# Altium schematic sheet Control.SchDoc
size 431 x 279 mm; Organization: ORGANIZATION; Address1: ADDRESS 1; Address2: ADDRESS 2; Address3: ADDRESS 3; Address4: ADDRESS 4; Revision: -; SheetNumber: 5; SheetTotal: 8; ENG_APP_DATE: --/--/--; DSN_APP_DATE: --/--/--; CHK_APP_DATE: --/--/--; SPICEModelCacheDZCMNMWT: <root> / <DocumentId>DZCMNMWT</DocumentId> / </root>
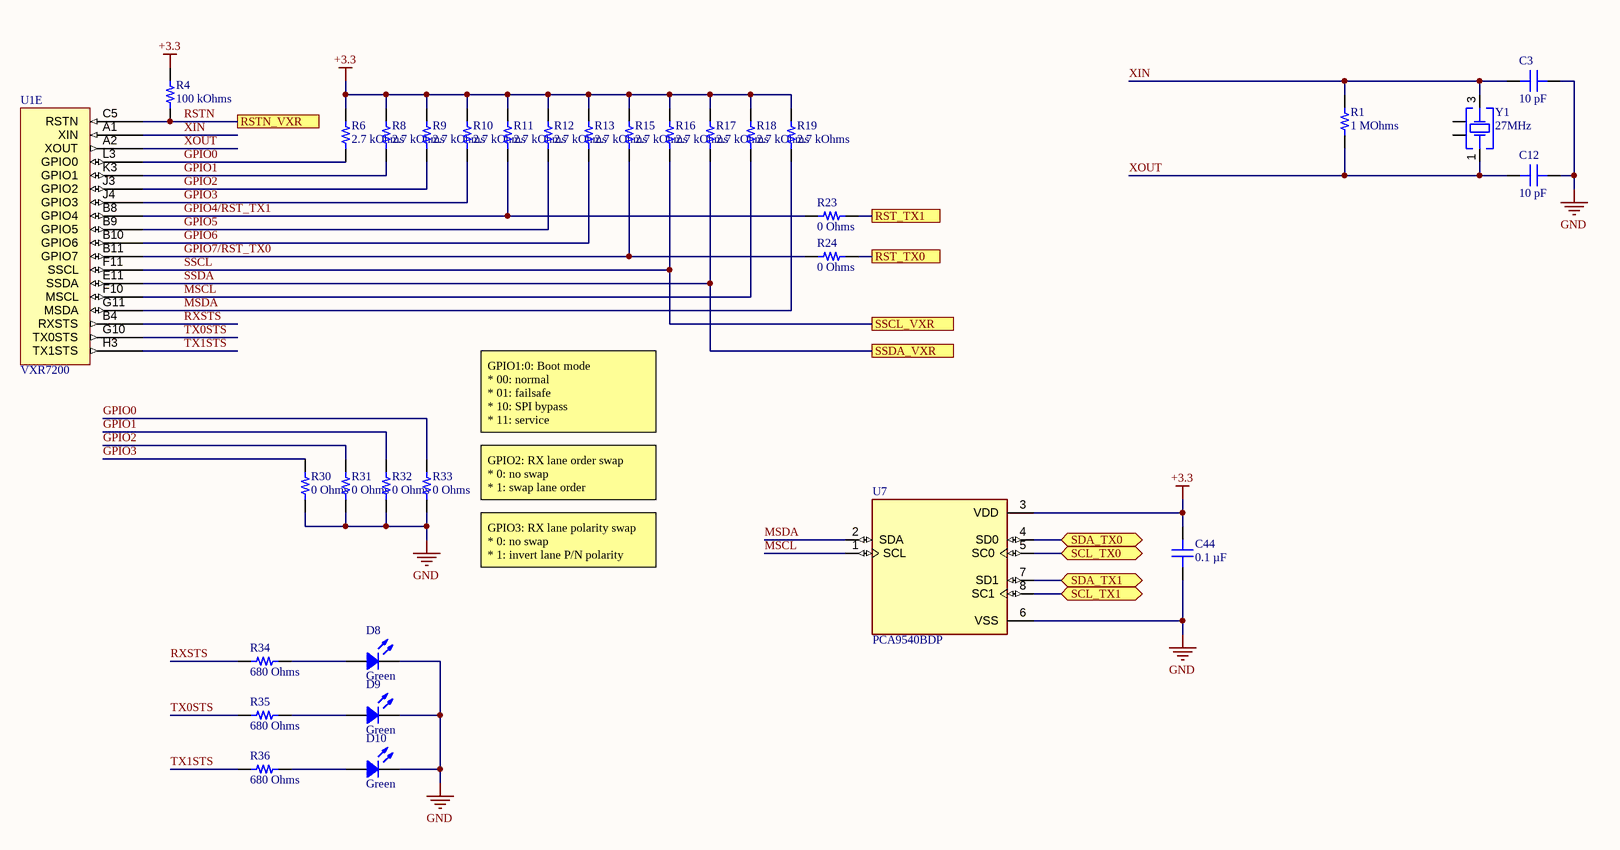
[diagram p0: Control.SchDoc]

## Parts
C3  10 pF  [CAP 0201_0603]
C12  10 pF  [CAP 0201_0603]
C44  0.1 µF  [CAP 0201_0603]
D8  Green  [LED 0603_1608 GREEN]
D9  Green  [LED 0603_1608 GREEN]
D10  Green  [LED 0603_1608 GREEN]
R1  1 MOhms  [RES 0201_0603]
R4  100 kOhms  [RES 0201_0603]
R6  2.7 kOhms  [RES 0201_0603]
R8  2.7 kOhms  [RES 0201_0603]
R9  2.7 kOhms  [RES 0201_0603]
R10  2.7 kOhms  [RES 0201_0603]
R11  2.7 kOhms  [RES 0201_0603]
R12  2.7 kOhms  [RES 0201_0603]
R13  2.7 kOhms  [RES 0201_0603]
R15  2.7 kOhms  [RES 0201_0603]
R16  2.7 kOhms  [RES 0201_0603]
R17  2.7 kOhms  [RES 0201_0603]
R18  2.7 kOhms  [RES 0201_0603]
R19  2.7 kOhms  [RES 0201_0603]
R23  0 Ohms  [RES 0402_1005]
R24  0 Ohms  [RES 0402_1005]
R30  0 Ohms  [RES 0402_1005]
R31  0 Ohms  [RES 0402_1005]
R32  0 Ohms  [RES 0402_1005]
R33  0 Ohms  [RES 0402_1005]
R34  680 Ohms  [RES 0402_1005]
R35  680 Ohms  [RES 0402_1005]
R36  680 Ohms  [RES 0402_1005]
U1  VXR7200  [BGA100P9X9-81A]  (part E of 9)
U7  PCA9540BDP  [SOP65P490X110-8N]
Y1  27MHz  [WE-XTAL_CFPX-218]

## Ports
RST_TX0, RST_TX1, RSTN_VXR, SCL_TX0 (bidir), SCL_TX1 (bidir), SDA_TX0 (bidir), SDA_TX1 (bidir), SSCL_VXR, SSDA_VXR

## Nets
+3.3: C44.2 R4.2 R6.2 R8.2 R9.2 R10.2 R11.2 R12.2 R13.2 R15.2 R16.2 R17.2 R18.2 R19.2 U7.3(VDD)
GND: C3.2 C12.2 C44.1 D8.2 D9.2 D10.2 R30.1 R31.1 R32.1 R33.1 U7.6(VSS)
GPIO0: R6.1 R33.2 U1.L3(GPIO0)
GPIO1: R8.1 R32.2 U1.K3(GPIO1)
GPIO2: R9.1 R31.2 U1.J3(GPIO2)
GPIO3: R10.1 R30.2 U1.J4(GPIO3)
GPIO4/RST_TX1: R11.1 R23.2 U1.B8(GPIO4)
GPIO5: R12.1 U1.B9(GPIO5)
GPIO6: R13.1 U1.B10(GPIO6)
GPIO7/RST_TX0: R15.1 R24.2 U1.B11(GPIO7)
MSCL: R18.1 U1.F10(MSCL) U7.1(SCL)
MSDA: R19.1 U1.G11(MSDA) U7.2(SDA)
RST_TX0: R24.1 ; port RST_TX0
RST_TX1: R23.1 ; port RST_TX1
RSTN: R4.1 U1.C5(RSTN) ; port RSTN_VXR
RXSTS: R34.1 U1.B4(RXSTS)
SCL_TX0: U7.5(SC0) ; port SCL_TX0
SCL_TX1: U7.8(SC1) ; port SCL_TX1
SDA_TX0: U7.4(SD0) ; port SDA_TX0
SDA_TX1: U7.7(SD1) ; port SDA_TX1
SSCL: R16.1 U1.F11(SSCL) ; port SSCL_VXR
SSDA: R17.1 U1.E11(SSDA) ; port SSDA_VXR
TX0STS: R35.1 U1.G10(TX0STS)
TX1STS: R36.1 U1.H3(TX1STS)
XIN: C3.1 R1.2 U1.A1(XIN) Y1.3(Crystal)
XOUT: C12.1 R1.1 U1.A2(XOUT) Y1.1(Crystal)
NetD8_1: D8.1 R34.2
NetD9_1: D9.1 R35.2
NetD10_1: D10.1 R36.2

Not connected (* = marked no-connect by the designer): Y1 2(GND) 4(GND)

## Notes on the sheet
- GPIO1:0: Boot mode
  * 00: normal
  * 01: failsafe
  * 10: SPI bypass
  * 11: service
- GPIO2: RX lane order swap
  * 0: no swap
  * 1: swap lane order
- GPIO3: RX lane polarity swap
  * 0: no swap
  * 1: invert lane P/N polarity
- DWG. NO.
- REV.
- SHT.
- REVISION
- DESCRIPTION
- DATE
- APPROVED
- ENG:
- APPROVALS
- PROJECT
- DSN:
- CHK:
- REFERENCE DOCUMENTS
- PROJECT REVISION:
- TITLE
- SimulaVR
- DOCUMENT REVISION:
- DESIGN ITEM:
- BOM:
- FAB DWG:
- PCB DWG:
- ASSY DWG:
- SCALE:
- SIZE
- B
- CAGE CODE
- FILE NAME
- DWG NO.
- SHEET
- OF
- REV

## Library data of the parts
C3 C12 = GRM0335C1E100JA01D: CAP CER 10PF 25V C0G/NP0 0201; manufacturer: Murata Electronics; Temperature Coefficient: C0G, NP0; Tolerance: ±5%; Part Number: GRM0335C1E100JA01D; Value: 10 pF; Applications: General Purpose; Capacitance: 10 pF; componentlink1description: Datasheet; componentlink1url: https://search.murata.co.jp/Ceramy/image/img/A01X/G101/ENG/GRM0335C1E100JA01-01.pdf; componentlink2description: DigiKey Link; componentlink2url: https://www.digikey.com/en/products/detail/murata-electronics/GRM0335C1E100JA01D/4358173; Device Package: 0201 (0603 Metric); lastupdated: 2022-04-12 22:02:08; Lifecycle Status: Active; Minimum Order: 1; Mounting Type: Surface Mount, MLCC; Operating Temperature: -55°C ~ 125°C; Package / Case: 0201 (0603 Metric); packaging: CutTape; partid: 180; Part Status: Active; price: 0.01; series: GRM; Size / Dimension: 0.024" L x 0.012" W (0.60mm x 0.30mm); Supplier 1: DigiKey; Supplier Part Number 1: 490-8607-1-ND; Thickness (Max): 0.013" (0.33mm); Voltage - Rated: 25V
C44 = GRM033R61E104KE14D: CAP CER 0.1UF 25V X5R 0201; manufacturer: Murata Electronics; Tolerance: ±10%; Part Number: GRM033R61E104KE14D; Value: 0.1 µF; Applications: General Purpose; Capacitance: 0.1 µF; componentlink1description: Datasheet; componentlink1url: https://search.murata.co.jp/Ceramy/image/img/A01X/G101/ENG/GRM033R61E104KE14-01.pdf; componentlink2description: DigiKey Link; componentlink2url: https://www.digikey.com/en/products/detail/murata-electronics/GRM033R61E104KE14D/4904731; Device Package: 0201 (0603 Metric); lastupdated: 5/20/2022 2:33:00 PM; Lifecycle Status: Active; Minimum Order: 1; Mounting Type: Surface Mount; Operating Temperature: -55°C ~ 85°C; Package / Case: 0201 (0603 Metric); packaging: TapeAndReel; partid: 39731; Part Status: Active; price: 0.01; series: GRM; Size / Dimension: 0.024" L x 0.012" W (0.60mm x 0.30mm); Supplier 1: DigiKey; Supplier Part Number 1: 490-12686-1-ND; Temperature Coefficient: X5R; Thickness (Max): 0.013" (0.33mm); Voltage - Rated: 25V
D8-D10 = 150060GS55040: LED GREEN DIFFUSED 0603 SMD; Manufacturer: Würth Elektronik; Configuration: Standard; Current - Test: 20mA; Lens Color: 0.50mm; Lens Size: 1.00mm x 0.80mm; Lens Style: Rectangle with Flat Top; Millicandela Rating: 430mcd; Viewing Angle: 140°; Voltage - Forward (Vf) (Typ): 3.2V; Wavelength - Dominant: 525nm; Wavelength - Peak: 520nm; Part Number: 150060GS55040; Color: Green; ComponentLink1Description: Datasheet; ComponentLink1URL: https://www.we-online.de/web/en/index.php/download/media/07_electronic_components/download_center_1/application_notes_berichte/ano002_leds___the_future_of_horticultural_lighting/ANO002b_EN_LEDs_The_Future_of_Horticultural_Lighting.pdf; ComponentLink2Description: DigiKey Link; ComponentLink2URL: https://www.digikey.com/en/products/detail/würth-elektronik/150060GS55040/8557179; Device Package: 0603 (1608 Metric); Height (Max): 0.50mm; LastUpdated: 2022-04-12 22:51:58; Lens Transparency: Diffused; Lifecycle Status: Active; Minimum Order: 1; Mounting Type: Surface Mount; Package / Case: 0603 (1608 Metric); Packaging: TapeAndReel; PartId: 673; Part Status: Active; Price: 0.13; Series: WL-SMDC; Size / Dimension: 1.60mm L x 0.80mm W; Supplier 1: DigiKey; Supplier Part Number 1: 732-12014-1-ND; Supplier Device Package: 0603 (1608 Metric); Value: Green
R1 = CRCW02011M00FKED: RES SMD 1M OHM 1% 1/20W 0201; Manufacturer: Vishay Dale; Power (Watts): 0.05W, 1/20W; Temperature Coefficient: ±100ppm/°C; Part Number: CRCW02011M00FKED; Value: 1 MOhms; ComponentLink1Description: Datasheet; ComponentLink1URL: http://www.vishay.com/docs/20052/crcw0201e3.pdf; ComponentLink2Description: DigiKey Link; ComponentLink2URL: https://www.digikey.com/en/products/detail/vishay-dale/CRCW02011M00FKED/1968003; Composition: Thick Film; Device Package: 0201 (0603 Metric); Height - Seated (Max): 0.010" (0.26mm); LastUpdated: 2022-04-12 22:16:01; Lifecycle Status: Active; Minimum Order: 1; Number of Terminations: 2; Operating Temperature: -55°C ~ 155°C; Package / Case: 0201 (0603 Metric); Packaging: TapeAndReel; PartId: 30; Part Status: Active; Price: 0.03; Resistance: 1 MOhms; Series: CRCW; Size / Dimension: 0.024" L x 0.012" W (0.60mm x 0.30mm); Supplier 1: DigiKey; Supplier Part Number 1: 541-1.00MAABCT-ND; Supplier Device Package: 0201; Tolerance: ±1%
R4 = ERJ-U01F1003C: RES 100K OHM 1% 1/20W 0201 SMD; Manufacturer: Panasonic Electronic Components; Power (Watts): 0.05W, 1/20W; Temperature Coefficient: ±200ppm/°C; Part Number: ERJ-U01F1003C; Value: 100 kOhms; ComponentLink1Description: Datasheet; ComponentLink1URL: https://industrial.panasonic.com/cdbs/www-data/pdf/RDP0000/AOA0000C334.pdf; ComponentLink2Description: DigiKey Link; ComponentLink2URL: https://www.digikey.com/en/products/detail/panasonic-electronic-components/ERJ-U01F1003C/11631500; Composition: Thick Film; Device Package: 0201 (0603 Metric); Features: Anti-Sulfur; Height - Seated (Max): 0.010" (0.26mm); LastUpdated: 2022-04-12 22:15:26; Lifecycle Status: Active; Minimum Order: 1; Number of Terminations: 2; Operating Temperature: -55°C ~ 125°C; Package / Case: 0201 (0603 Metric); Packaging: TapeAndReel; PartId: 64617; Part Status: Active; Price: 0.05; Resistance: 100 kOhms; Series: ERJ-U01; Size / Dimension: 0.024" L x 0.012" W (0.60mm x 0.30mm); Supplier 1: DigiKey; Supplier Part Number 1: 10-ERJ-U01F1003CCT-ND; Supplier Device Package: 0201; Tolerance: ±1%
R6 R8-R13 R15-R19 = ERJ-U01J272C: RES 2.7K OHM 5% 1/20W 0201 SMD; Manufacturer: Panasonic Electronic Components; Power (Watts): 0.05W, 1/20W; Temperature Coefficient: ±200ppm/°C; Part Number: ERJ-U01J272C; Value: 2.7 kOhms; ComponentLink1Description: Datasheet; ComponentLink1URL: https://industrial.panasonic.com/cdbs/www-data/pdf/RDP0000/AOA0000C334.pdf; ComponentLink2Description: DigiKey Link; ComponentLink2URL: https://www.digikey.com/en/products/detail/panasonic-electronic-components/ERJ-U01J272C/11641374; Composition: Thick Film; Device Package: 0201 (0603 Metric); Features: Anti-Sulfur; Height - Seated (Max): 0.010" (0.26mm); LastUpdated: 2022-04-12 22:15:26; Lifecycle Status: Active; Minimum Order: 1; Number of Terminations: 2; Operating Temperature: -55°C ~ 125°C; Package / Case: 0201 (0603 Metric); Packaging: TapeAndReel; PartId: 64645; Part Status: Active; Price: 0.04; Resistance: 2.7 kOhms; Series: ERJ-U01; Size / Dimension: 0.024" L x 0.012" W (0.60mm x 0.30mm); Supplier 1: DigiKey; Supplier Part Number 1: 10-ERJ-U01J272CCT-ND; Supplier Device Package: 0201; Tolerance: ±5%
R23 R24 R30-R33 = AC0402FR-070RL: RESISTOR 0402 JUMPER ZERO OHM; Manufacturer: Yageo; Power (Watts): 0.063W, 1/16W; Part Number: AC0402FR-070RL; Value: 0 Ohms; ComponentLink1Description: Datasheet; ComponentLink1URL: https://www.yageo.com/upload/media/product/productsearch/datasheet/rchip/PYu-AC_51_RoHS_L_8.pdf; ComponentLink2Description: DigiKey Link; ComponentLink2URL: https://www.digikey.com/en/products/detail/yageo/AC0402FR-070RL/12082398; Composition: Thick Film; Device Package: 0402 (1005 Metric); Features: Automotive AEC-Q200, Moisture Resistant; Height - Seated (Max): 0.015" (0.37mm); LastUpdated: 2022-04-12 22:19:37; Lifecycle Status: Active; Minimum Order: 1; Number of Terminations: 2; Operating Temperature: -55°C ~ 155°C; Package / Case: 0402 (1005 Metric); Packaging: CutTape; PartId: 66976; Part Status: Active; Price: 0.01; Ratings: AEC-Q200; Resistance: 0 Ohms; Series: AC; Size / Dimension: 0.039" L x 0.020" W (1.00mm x 0.50mm); Supplier 1: DigiKey; Supplier Part Number 1: 13-AC0402FR-070RLCT-ND; Supplier Device Package: 0402; Tolerance: Jumper
R34-R36 = RCS0402680RFKED: RES SMD 680 OHM 1% 1/5W 0402; Manufacturer: Vishay Dale; Power (Watts): 0.2W, 1/5W; Temperature Coefficient: ±100ppm/°C; Part Number: RCS0402680RFKED; Value: 680 Ohms; ComponentLink1Description: Datasheet; ComponentLink1URL: http://www.vishay.com/docs/20065/rcse3.pdf; ComponentLink2Description: DigiKey Link; ComponentLink2URL: https://www.digikey.com/en/products/detail/vishay-dale/RCS0402680RFKED/5867679; Composition: Thick Film; Device Package: 0402 (1005 Metric); Features: Automotive AEC-Q200, Pulse Withstanding; Height - Seated (Max): 0.016" (0.40mm); LastUpdated: 2022-04-12 22:21:08; Lifecycle Status: Active; Minimum Order: 1; Number of Terminations: 2; Operating Temperature: -55°C ~ 155°C; Package / Case: 0402 (1005 Metric); Packaging: TapeAndReel; PartId: 6056; Part Status: Active; Price: 0.01; Ratings: AEC-Q200; Resistance: 680 Ohms; Series: RCS e3; Size / Dimension: 0.039" L x 0.020" W (1.00mm x 0.50mm); Supplier 1: DigiKey; Supplier Part Number 1: 541-10420-1-ND; Supplier Device Package: 0402; Tolerance: ±1%
U1 = CMP-015-00008-4: VXR7200 DP to MIPI-DSI bridge
U7 = PCA9540BDP: 2-Channel IﾂｲC Multiplexer Interface 8-TSSOP; MF: {'manufacturer': u'NXP USA'}; Price: None; Value: *; Package: None; MP: PCA9540BDP; Availability: Unavailable
Y1 = 830108208409: WE-XTAL Quartz Crystal, SMT, CFPX-218, 27MHz, +/-10ppm; Manufacturer: Wurth Elektronik; Load Capacitance: 10pF; ComponentLink1Description: Manufacturer; ComponentLink1URL: http://www.we-online.de; ComponentLink2Description: Datasheet; ComponentLink2URL: https://katalog.we-online.com/pbs/datasheet/830108208409.pdf; Operating Temperature: -20 to +70degC; Packaging: Tape and Reel; Manufacturer Part Number: 830108208409; Published Date: July 2020; Size: CFPX-218; Frequency Stability: +/-10ppm; Frequency: 27MHz; Frequency Tolerance: +/-10ppm; Mounting Technology: SMT